# Altium project DVI-D_out.PrjPCB
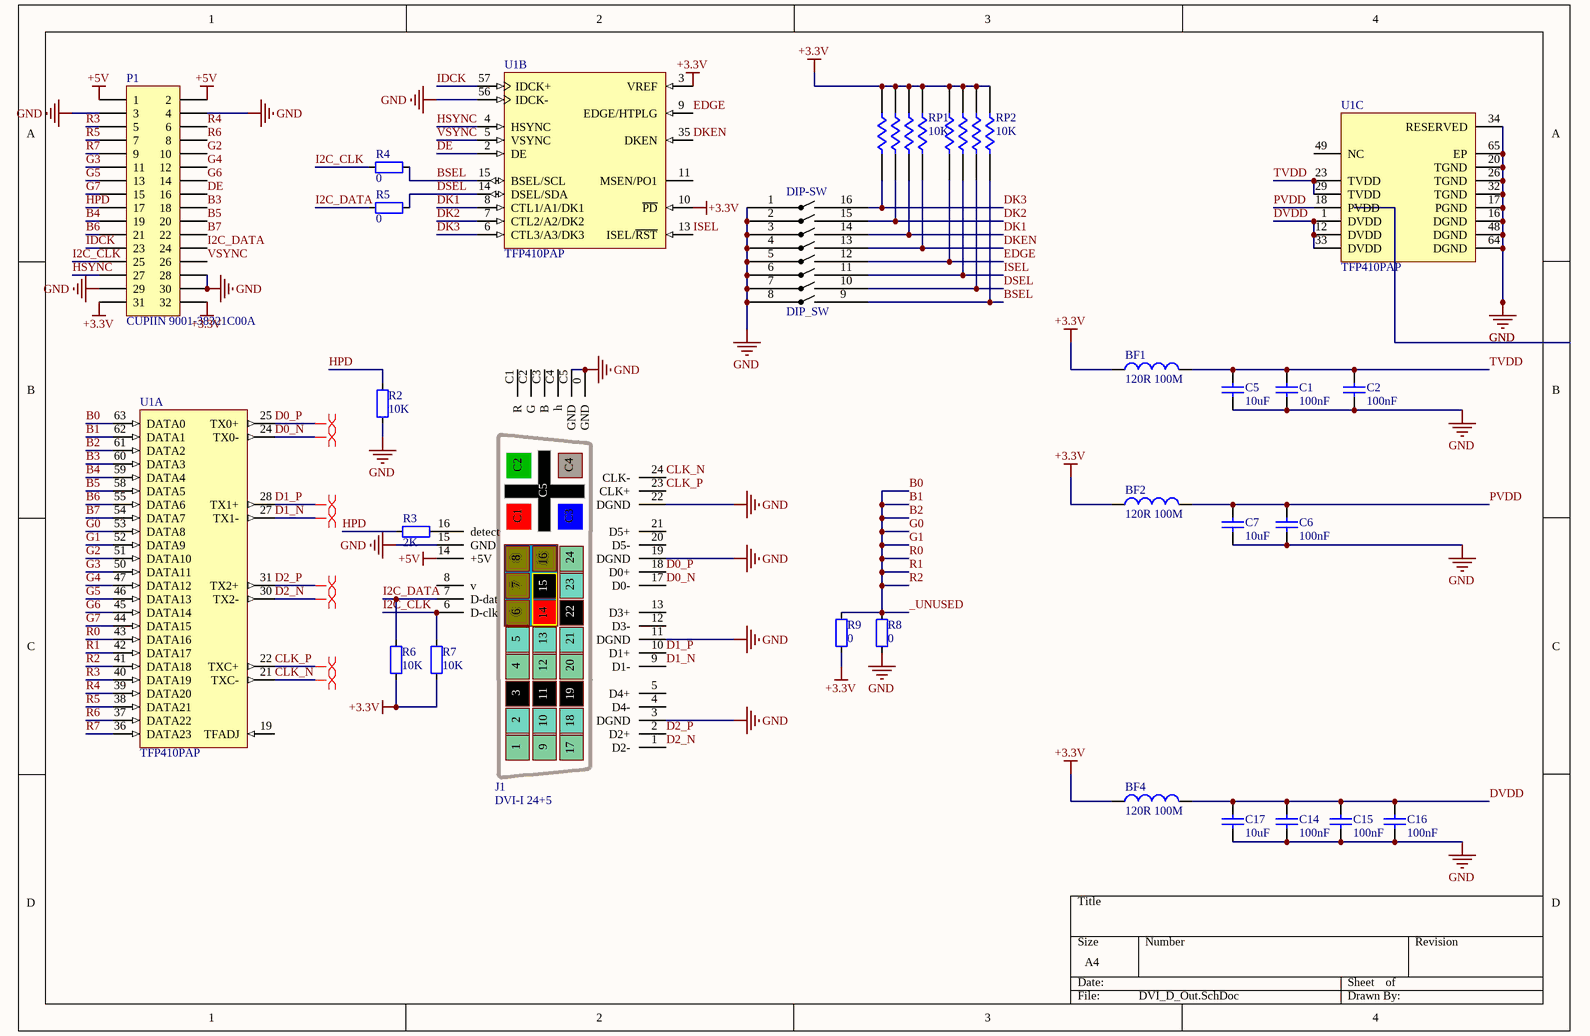
[diagram p0: DVI_D_Out.SchDoc]
1 sheet, 26 parts. Net scope: global (net labels, ports and power ports of the same name join across sheets).
Board file: DVI_D_out.PcbDoc

## Sheet DVI_D_Out.SchDoc
size A4

### Parts
BF1  value 120R 100M  [L-1608[0603]]  (hidden comment: GZ1608D121TF)
BF2  value 120R 100M  [L-1608[0603]]  (hidden comment: GZ1608D121TF)
BF4  value 120R 100M  [L-1608[0603]]  (hidden comment: GZ1608D121TF)
C1  value 100nF  [C-1608[0603]]  (hidden comment: Cap Semi)
C2  value 100nF  [C-1608[0603]]  (hidden comment: Cap Semi)
C5  value 10uF  [C-1608[0603]]  (hidden comment: Cap Semi)
C6  value 100nF  [C-1608[0603]]  (hidden comment: Cap Semi)
C7  value 10uF  [C-1608[0603]]  (hidden comment: Cap Semi)
C14  value 100nF  [C-1608[0603]]  (hidden comment: Cap Semi)
C15  value 100nF  [C-1608[0603]]  (hidden comment: Cap Semi)
C16  value 100nF  [C-1608[0603]]  (hidden comment: Cap Semi)
C17  value 10uF  [C-1608[0603]]  (hidden comment: Cap Semi)
DIP-SW  DIP_SW  [SO16W]
J1  DVI-I 24+5  [DVI-I]
P1  CUPIIN 9001-38321C00A  [OUPIIN 9001-38321C00A]
R2  value 10K  [RES_0603]  (hidden comment: Res_0603)
R3  value 2K  [RES_0603]  (hidden comment: Res_0603)
R4  value 0  [RES_0603]  (hidden comment: Res_0603)
R5  value 0  [RES_0603]  (hidden comment: Res_0603)
R6  value 10K  [RES_0603]  (hidden comment: Res_0603)
R7  value 10K  [RES_0603]  (hidden comment: Res_0603)
R8  value 0  [RES_0603]  (hidden comment: Res_0603)
R9  value 0  [RES_0603]  (hidden comment: Res_0603)
RP1  10K  [R0603x4]
RP2  10K  [R0603x4]
U1  TFP410PAP  [PAP64-4650X4650TP_N]  (parts A,B,C of 3)

### Nets
+3.3V: BF1.1 BF2.1 BF4.1 P1.31 P1.32 R6.2 R7.2 R9.2 RP1.5 RP1.6 RP1.7 RP1.8 RP2.5 RP2.6 RP2.7 RP2.8 U1.3(VREF) U1.10(~{PD})
+5V: J1.14(+5V) P1.1 P1.2
GND: C1.1 C2.1 C5.1 C6.1 C7.1 C14.1 C15.1 C16.1 C17.1 DIP-SW.1 DIP-SW.2 DIP-SW.3 DIP-SW.4 DIP-SW.5 DIP-SW.6 DIP-SW.7 DIP-SW.8 J1.0(GND) J1.3(DGND) J1.11(DGND) J1.15(GND) J1.19(DGND) J1.22(DGND) J1.C5(GND) P1.3 P1.4 P1.28 P1.29 P1.30 R2.1 R8.2 U1.16(DGND) U1.17(PGND) U1.20(TGND) U1.26(TGND) U1.32(TGND) U1.34(RESERVED) U1.48(DGND) U1.56(IDCK-) U1.64(DGND) U1.65(EP)
_UNUSED: R8.1 R9.1 U1.41(DATA18) U1.42(DATA17) U1.43(DATA16) U1.52(DATA9) U1.53(DATA8) U1.61(DATA2) U1.62(DATA1) U1.63(DATA0)  [also labelled B0, B1, B2, G0, G1, R0, R1, R2]
B3: P1.18 U1.60(DATA3)
B4: P1.19 U1.59(DATA4)
B5: P1.20 U1.58(DATA5)
B6: P1.21 U1.55(DATA6)
B7: P1.22 U1.54(DATA7)
BSEL: DIP-SW.9 R4.1 RP2.4 U1.15(BSEL/SCL)
CLK_N: J1.24(CLK-) U1.21(TXC-)
CLK_P: J1.23(CLK+) U1.22(TXC+)
D0_N: J1.17(D0-) U1.24(TX0-)
D0_P: J1.18(D0+) U1.25(TX0+)
D1_N: J1.9(D1-) U1.27(TX1-)
D1_P: J1.10(D1+) U1.28(TX1+)
D2_N: J1.1(D2-) U1.30(TX2-)
D2_P: J1.2(D2+) U1.31(TX2+)
DE: P1.16 U1.2(DE)
DK1: DIP-SW.14 RP1.3 U1.8(CTL1/A1/DK1)
DK2: DIP-SW.15 RP1.2 U1.7(CTL2/A2/DK2)
DK3: DIP-SW.16 RP1.1 U1.6(CTL3/A3/DK3)
DKEN: DIP-SW.13 RP1.4 U1.35(DKEN)
DSEL: DIP-SW.10 R5.1 RP2.3 U1.14(DSEL/SDA)
DVDD: BF4.2 C14.2 C15.2 C16.2 C17.2 U1.1(DVDD) U1.12(DVDD) U1.33(DVDD)
EDGE: DIP-SW.12 RP2.1 U1.9(EDGE/HTPLG)
G2: P1.10 U1.51(DATA10)
G3: P1.11 U1.50(DATA11)
G4: P1.12 U1.47(DATA12)
G5: P1.13 U1.46(DATA13)
G6: P1.14 U1.45(DATA14)
G7: P1.15 U1.44(DATA15)
HPD: P1.17 R2.2 R3.2
HSYNC: P1.27 U1.4(HSYNC)
I2C_CLK: J1.6(D-clk) P1.25 R4.2 R7.1
I2C_DATA: J1.7(D-dat) P1.24 R5.2 R6.1
IDCK: P1.23 U1.57(IDCK+)
ISEL: DIP-SW.11 RP2.2 U1.13(ISEL/~{RST})
PVDD: BF2.2 C6.2 C7.2 U1.18(PVDD)
R3: P1.5 U1.40(DATA19)
R4: P1.6 U1.39(DATA20)
R5: P1.7 U1.38(DATA21)
R6: P1.8 U1.37(DATA22)
R7: P1.9 U1.36(DATA23)
TVDD: BF1.2 C1.2 C2.2 C5.2 U1.23(TVDD) U1.29(TVDD)
VSYNC: P1.26 U1.5(VSYNC)
NetJ1_16: J1.16(detect) R3.1

Not connected (* = marked no-connect by the designer): J1 4(D4-) 5(D4+) 8(v) 12(D3-) 13(D3+) 20(D5-) 21(D5+) C1(R) C2(G) C3(B) C4(h); U1 11(MSEN/PO1) 19(TFADJ) 49(NC)

### Layout directives
differential pair: CLK_N, CLK_P, D0_N, D0_P, D1_N, D1_P, D2_N, D2_P

### Library data of the parts
BF1 BF2 BF4 = Inductor: Code_IEC: 1005; Published: 8-Jun-2000; LatestRevisionDate: 29-May-2009; LatestRevisionNote: IPC-7351 Footprint Added.; PackageReference: 0402-A; Publisher: Altium Limited; PackageDescription: Chip Inductor; Code_JEITA: 0402
C1 C2 C5-C7 C14-C17 = Cap Semi: Capacitor (Semiconductor SIM Model); Published: 8-Jun-2000; LatestRevisionDate: 29-May-2009; LatestRevisionNote: IPC-7351 Footprint Added.; PackageReference: C1206; Publisher: Altium Limited; PackageDescription: Chip Capacitor
J1 = DVI-I
P1 = Header 16X2: Header, 16-Pin, Dual row; LatestRevisionDate: 17-Jul-2002; LatestRevisionNote: Re-released for DXP Platform.; Publisher: Altium Limited
R2-R9 = Res_0603: Resistor
RP1 RP2 = RPACK4
U1 = CMP-0325-00079-1: PanelBus DVI Transmitter 165 MHz with 3 Data Channels, 3.3 V, 0 to +70 degC, 64-pin HTQFP (PAP), Green (RoHS & no Sb/Br); Manufacturer: Texas Instruments; Number of Parallel Inputs: 24; SubFamily: PanelBus (DVI); Rating: Catalog; PLL Frequency(MHz): 25 to 165; Transmitter: TRUE; Serial Data Transmitter Channels: 3; Supply Voltage(s)(V): 3.3; Eco-Plan: Green (RoHS & no Sb/Br); PackageVersion: revC, Aug-2003; PackageReference: PAP64-4650X4650TP; DatasheetVersion: SLDS145B; PartNumber: TFP410PAP; ComponentLink1Description: Datasheet; Mounting Technology: Surface Mount; ComponentLink1URL: http://www.ti.com/general/docs/lit/getliterature.tsp?genericPartNumber=TFP410&fileType=pdf; ComponentLink2URL: SamplesURL:http://www.ti.com/product/tfp410#samples; PackageDescription: 64-Pin Plastic Quad Flat Pack, 10 x 10 mm Body, 0.5 mm Pitch, Exposed Pad; ComponentLink2Description: URL Link1; Code_JEDEC: MS-026; PartId: 1